# EAGLE design Alimentation (EAGLE 7.2.0)
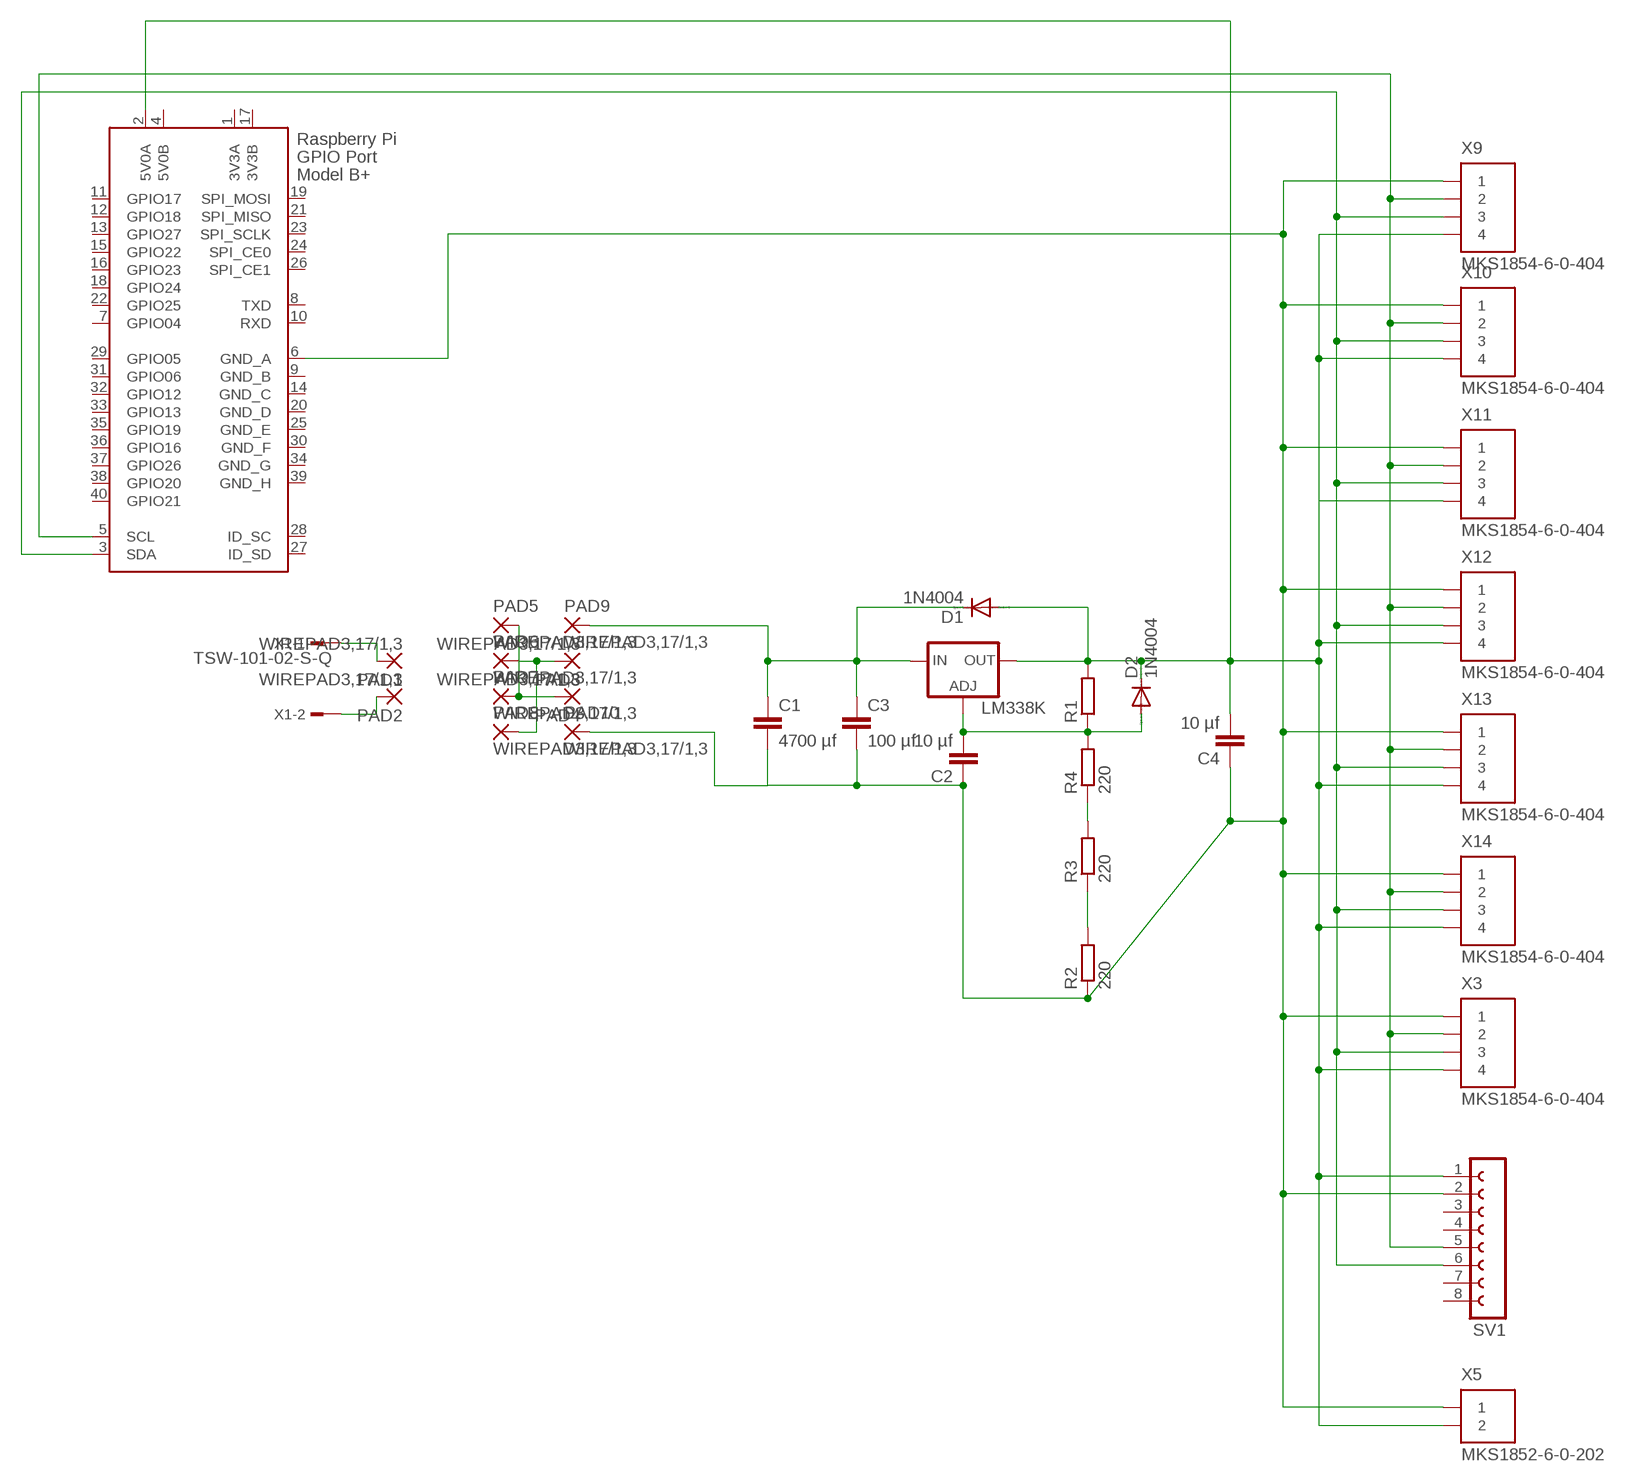
[diagram p0: schematic, sheet 1]

## Parts
C1  4700 µf  C-EU075-032X103  [C075-032X103]
C2  10 µf  C22/6  [C22.5B6]
C3  100 µf  C-EU050-075X075  [C050-075X075]
C4  10 µf  C22/6  [C22.5B6]
D1  1N4004  [DO41-10]
D2  1N4004  [DO41-10]
LM338K  LM317-TO3  [TO3-K02]
PAD1  WIREPAD3,17/1,3  [3,17/1,3]
PAD2  WIREPAD3,17/1,3  [3,17/1,3]
PAD3  WIREPAD3,17/1,3  [3,17/1,3]
PAD4  WIREPAD3,17/1,3  [3,17/1,3]
PAD5  WIREPAD3,17/1,3  [3,17/1,3]
PAD6  WIREPAD3,17/1,3  [3,17/1,3]
PAD7  WIREPAD3,17/1,3  [3,17/1,3]
PAD8  WIREPAD3,17/1,3  [3,17/1,3]
PAD9  WIREPAD3,17/1,3  [3,17/1,3]
PAD10  WIREPAD3,17/1,3  [3,17/1,3]
R1  R-EU_0309/12  [0309/12]
R2  220  R-EU_0309/12  [0309/12]
R3  220  R-EU_0309/12  [0309/12]
R4  220  R-EU_0309/12  [0309/12]
SV1  FE08-1  [FE08]
X1  TSW-101-02-S-Q  [TSW-101-02-S-Q]
X2  RASPI_GPIO_B+#_PIN  [RASPI_GPIO_B+_PIN]
X3  MKS1854-6-0-404  [MKS1854-6-0-404]
X5  MKS1852-6-0-202  [MKS1852-6-0-202]
X9  MKS1854-6-0-404  [MKS1854-6-0-404]
X10  MKS1854-6-0-404  [MKS1854-6-0-404]
X11  MKS1854-6-0-404  [MKS1854-6-0-404]
X12  MKS1854-6-0-404  [MKS1854-6-0-404]
X13  MKS1854-6-0-404  [MKS1854-6-0-404]
X14  MKS1854-6-0-404  [MKS1854-6-0-404]

## Nets
N$1: PAD1.1(P) X1.1
N$2: PAD2.1(P) X1.2
N$3: C1.2 C2.1 C3.2 C4.1 PAD10.1(P) R2.1 SV1.2 X2.6(GND_A) X3.1 X5.1 X9.1 X10.1 X11.1 X12.1 X13.1 X14.1
N$4: C1.1 C3.1 D1.C LM338K.1(IN) PAD9.1(P)
N$5: PAD3.1(P) PAD6.1(P) PAD8.1(P)
N$6: PAD4.1(P) PAD5.1(P) PAD7.1(P)
N$7: SV1.6 X2.3(SDA) X3.3 X9.3 X10.3 X11.3 X12.3 X13.3 X14.3
N$8: C2.2 D2.A LM338K.2(ADJ) R1.1 R4.2
N$9: R2.2 R3.1
N$10: C4.2 D1.A D2.C LM338K.3(OUT) R1.2 SV1.1 X2.2(5V0A) X3.4 X5.2 X9.4 X10.4 X11.4 X12.4 X13.4 X14.4
N$11: R3.2 R4.1
N$12: SV1.5 X2.5(SCL) X3.2 X9.2 X10.2 X11.2 X12.2 X13.2 X14.2
Unconnected: SV1.3 SV1.4 SV1.7 SV1.8 X2.7(GPIO04) X2.8(TXD) X2.10(RXD) X2.11(GPIO17) X2.12(GPIO18) X2.13(GPIO27) X2.15(GPIO22) X2.16(GPIO23) X2.18(GPIO24) X2.19(SPI_MOSI) X2.21(SPI_MISO) X2.22(GPIO25) X2.23(SPI_SCLK) X2.24(SPI_CE0) X2.26(SPI_CE1) X2.27(ID_SD) X2.28(ID_SC) X2.29(GPIO05) X2.31(GPIO06) X2.32(GPIO12) X2.33(GPIO13) X2.35(GPIO19) X2.36(GPIO16) X2.37(GPIO26) X2.38(GPIO20) X2.40(GPIO21)

## Power pins joined to a net without a drawn wire
3V3A: X2.1(3V3A)
3V3B: X2.17(3V3B)
5V0B: X2.4(5V0B)
GND_B: X2.9(GND_B)
GND_C: X2.14(GND_C)
GND_D: X2.20(GND_D)
GND_E: X2.25(GND_E)
GND_F: X2.30(GND_F)
GND_G: X2.34(GND_G)
GND_H: X2.39(GND_H)

## Library data of the parts
C1 C3 = rcl:C-EU: CAPACITOR, European symbol
C2 C4 = capacitor-wima:C: CAPACITOR naming: grid - package width
D1 D2 = diode:1N4004: DIODE general purpose rectifier, 1 A
LM338K = v-reg:LM317-TO3: VOLTAGE REGULATOR
PAD1-PAD10 = wirepad:WIREPAD: Wire PAD connect wire on PCB
R1-R4 = rcl:R-EU_: RESISTOR, European symbol
SV1 = con-lsta:FE08-1: FEMALE HEADER; OC_FARNELL: unknown; OC_NEWARK: unknown
X1 = con-samtec:TSW-101-02-S-Q: THROUGH-HOLE .025" SQ POST HEADER Source: Samtec TSW.pdf; OC_FARNELL: unknown; OC_NEWARK: unknown
X2 = raspberrypi_Bastelstube_v13:RASPI_GPIO_B+#: 2x20 header connector, all pins connected
X3 X9-X14 = con-stocko:MKS1854-6-0-404: Serie MKS 1850 Lötstifte In-line, Raster 2.5 mm, Stiftwannen, stehend, mit Rastlasche Source: http://www.stocko.de/de/index.php?seite=ka_rfk2_mks1850.html&rubrik=Katalog+-+RFK+2 rfk_1850.pdf; OC_FARNELL: 1141862; OC_NEWARK: unknown
X5 = con-stocko:MKS1852-6-0-202: Serie MKS 1850 Lötstifte In-line, Raster 2.5 mm, Stiftwannen, stehend, mit Rastlasche Source: http://www.stocko.de/de/index.php?seite=ka_rfk2_mks1850.html&rubrik=Katalog+-+RFK+2 rfk_1850.pdf; OC_FARNELL: unknown; OC_NEWARK: unknown

## Board
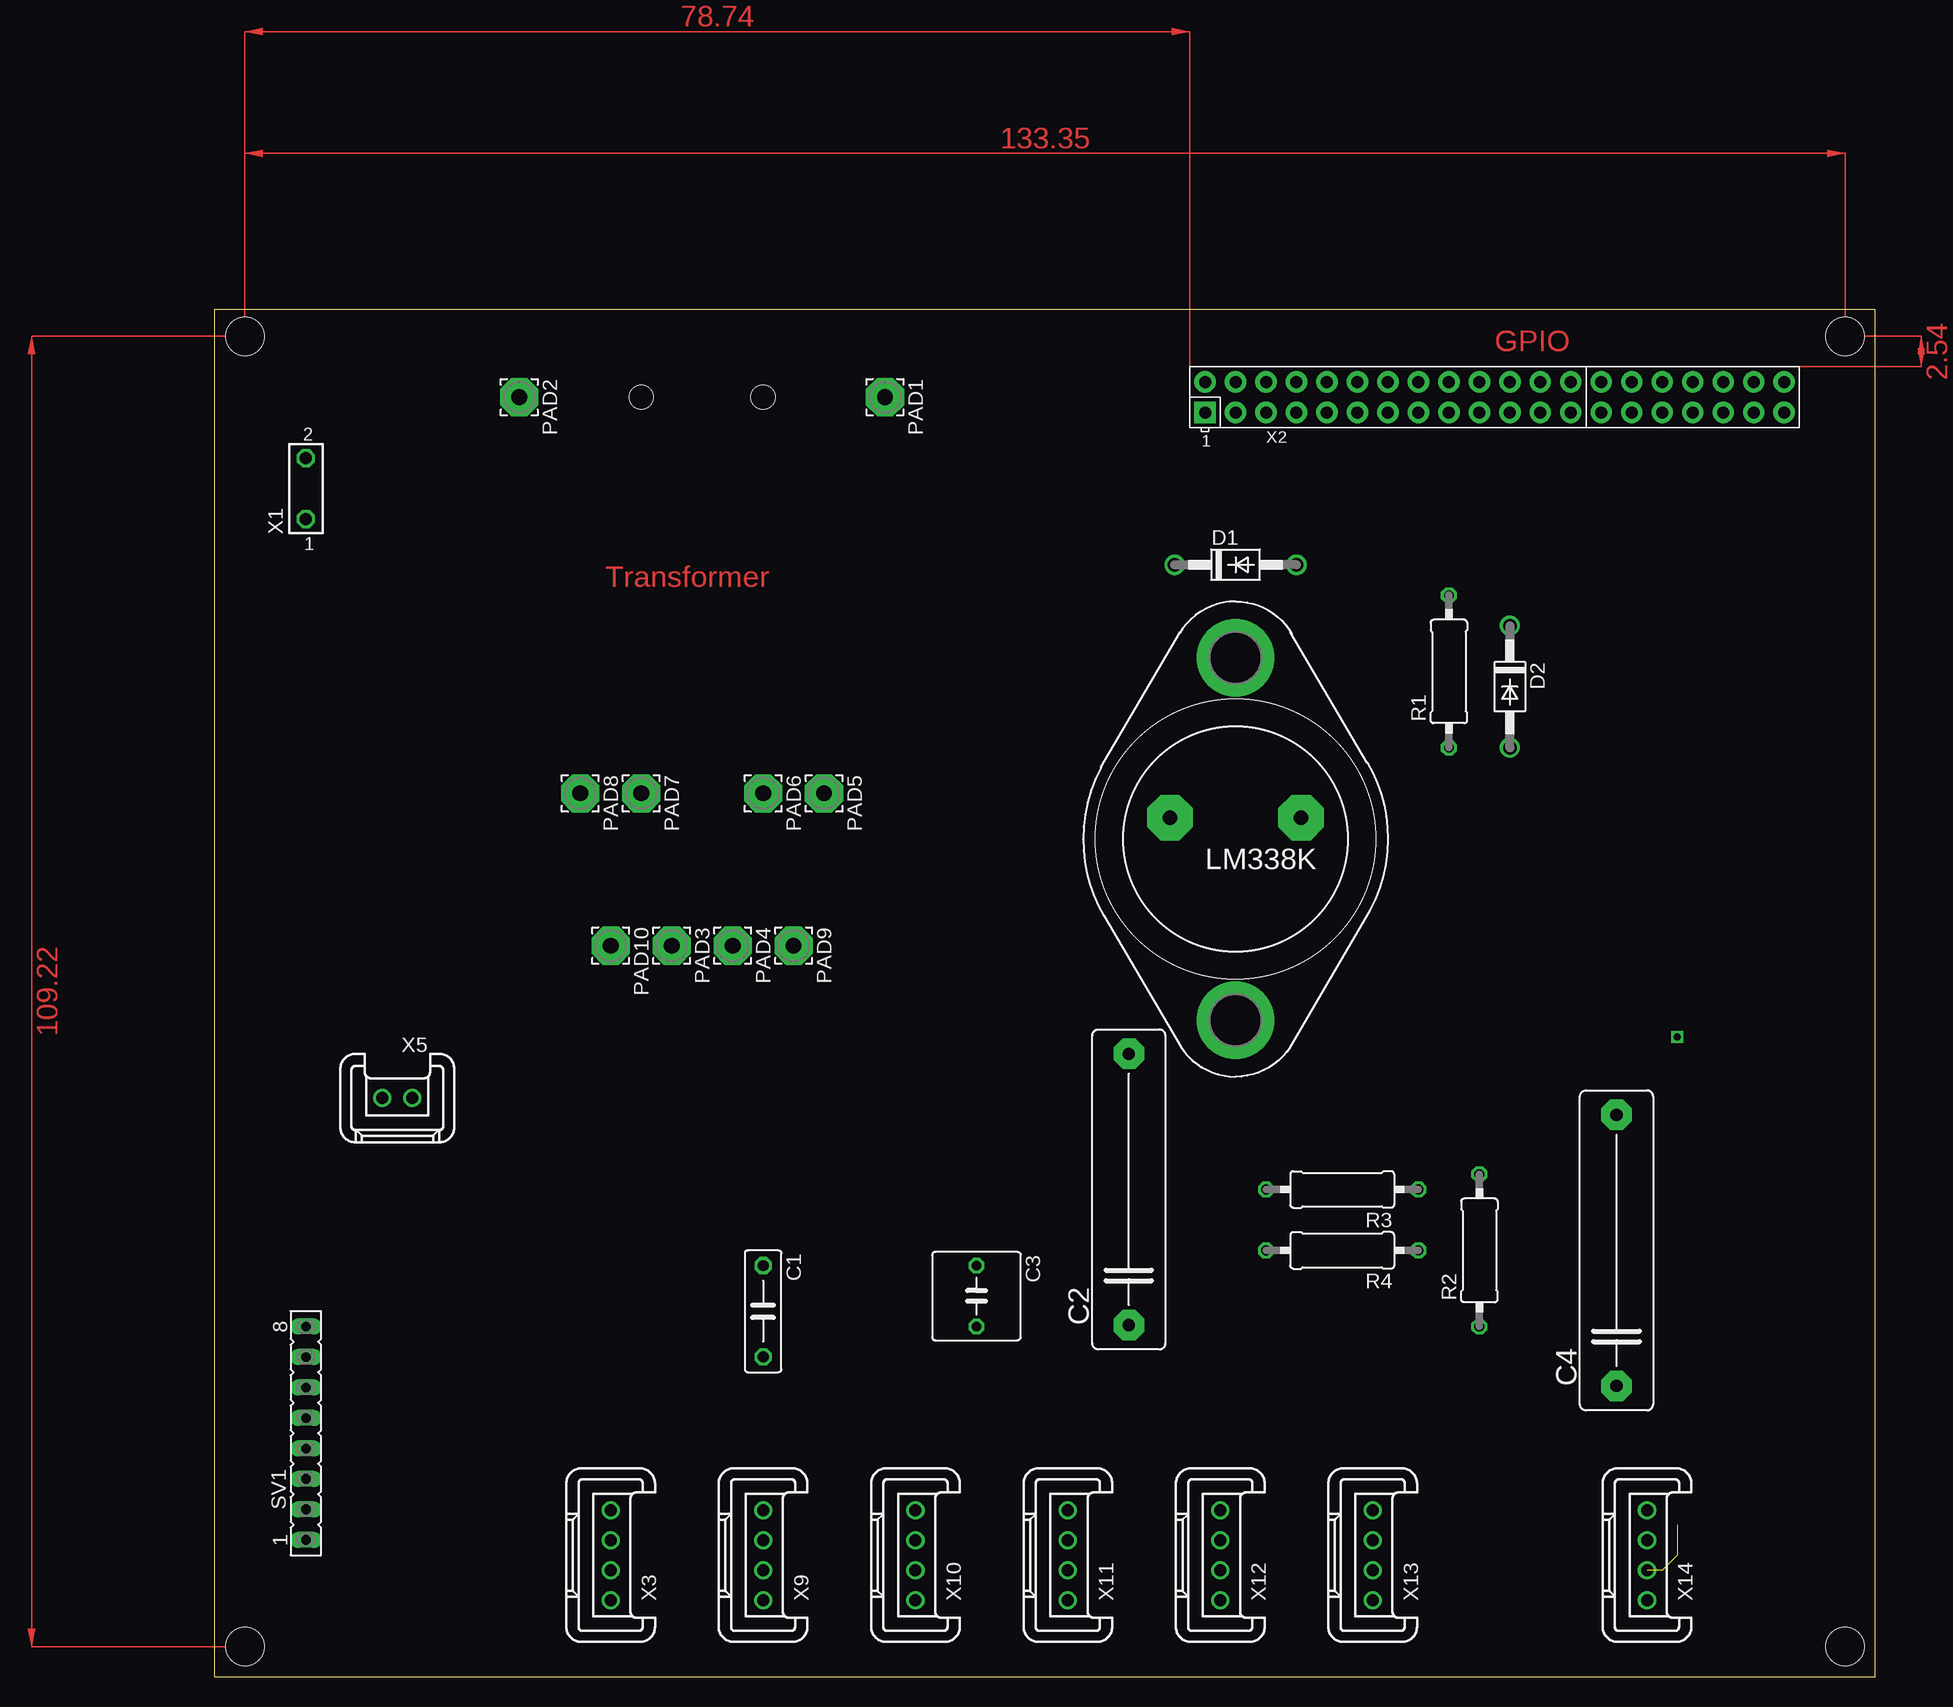
[diagram p1: board, top side]
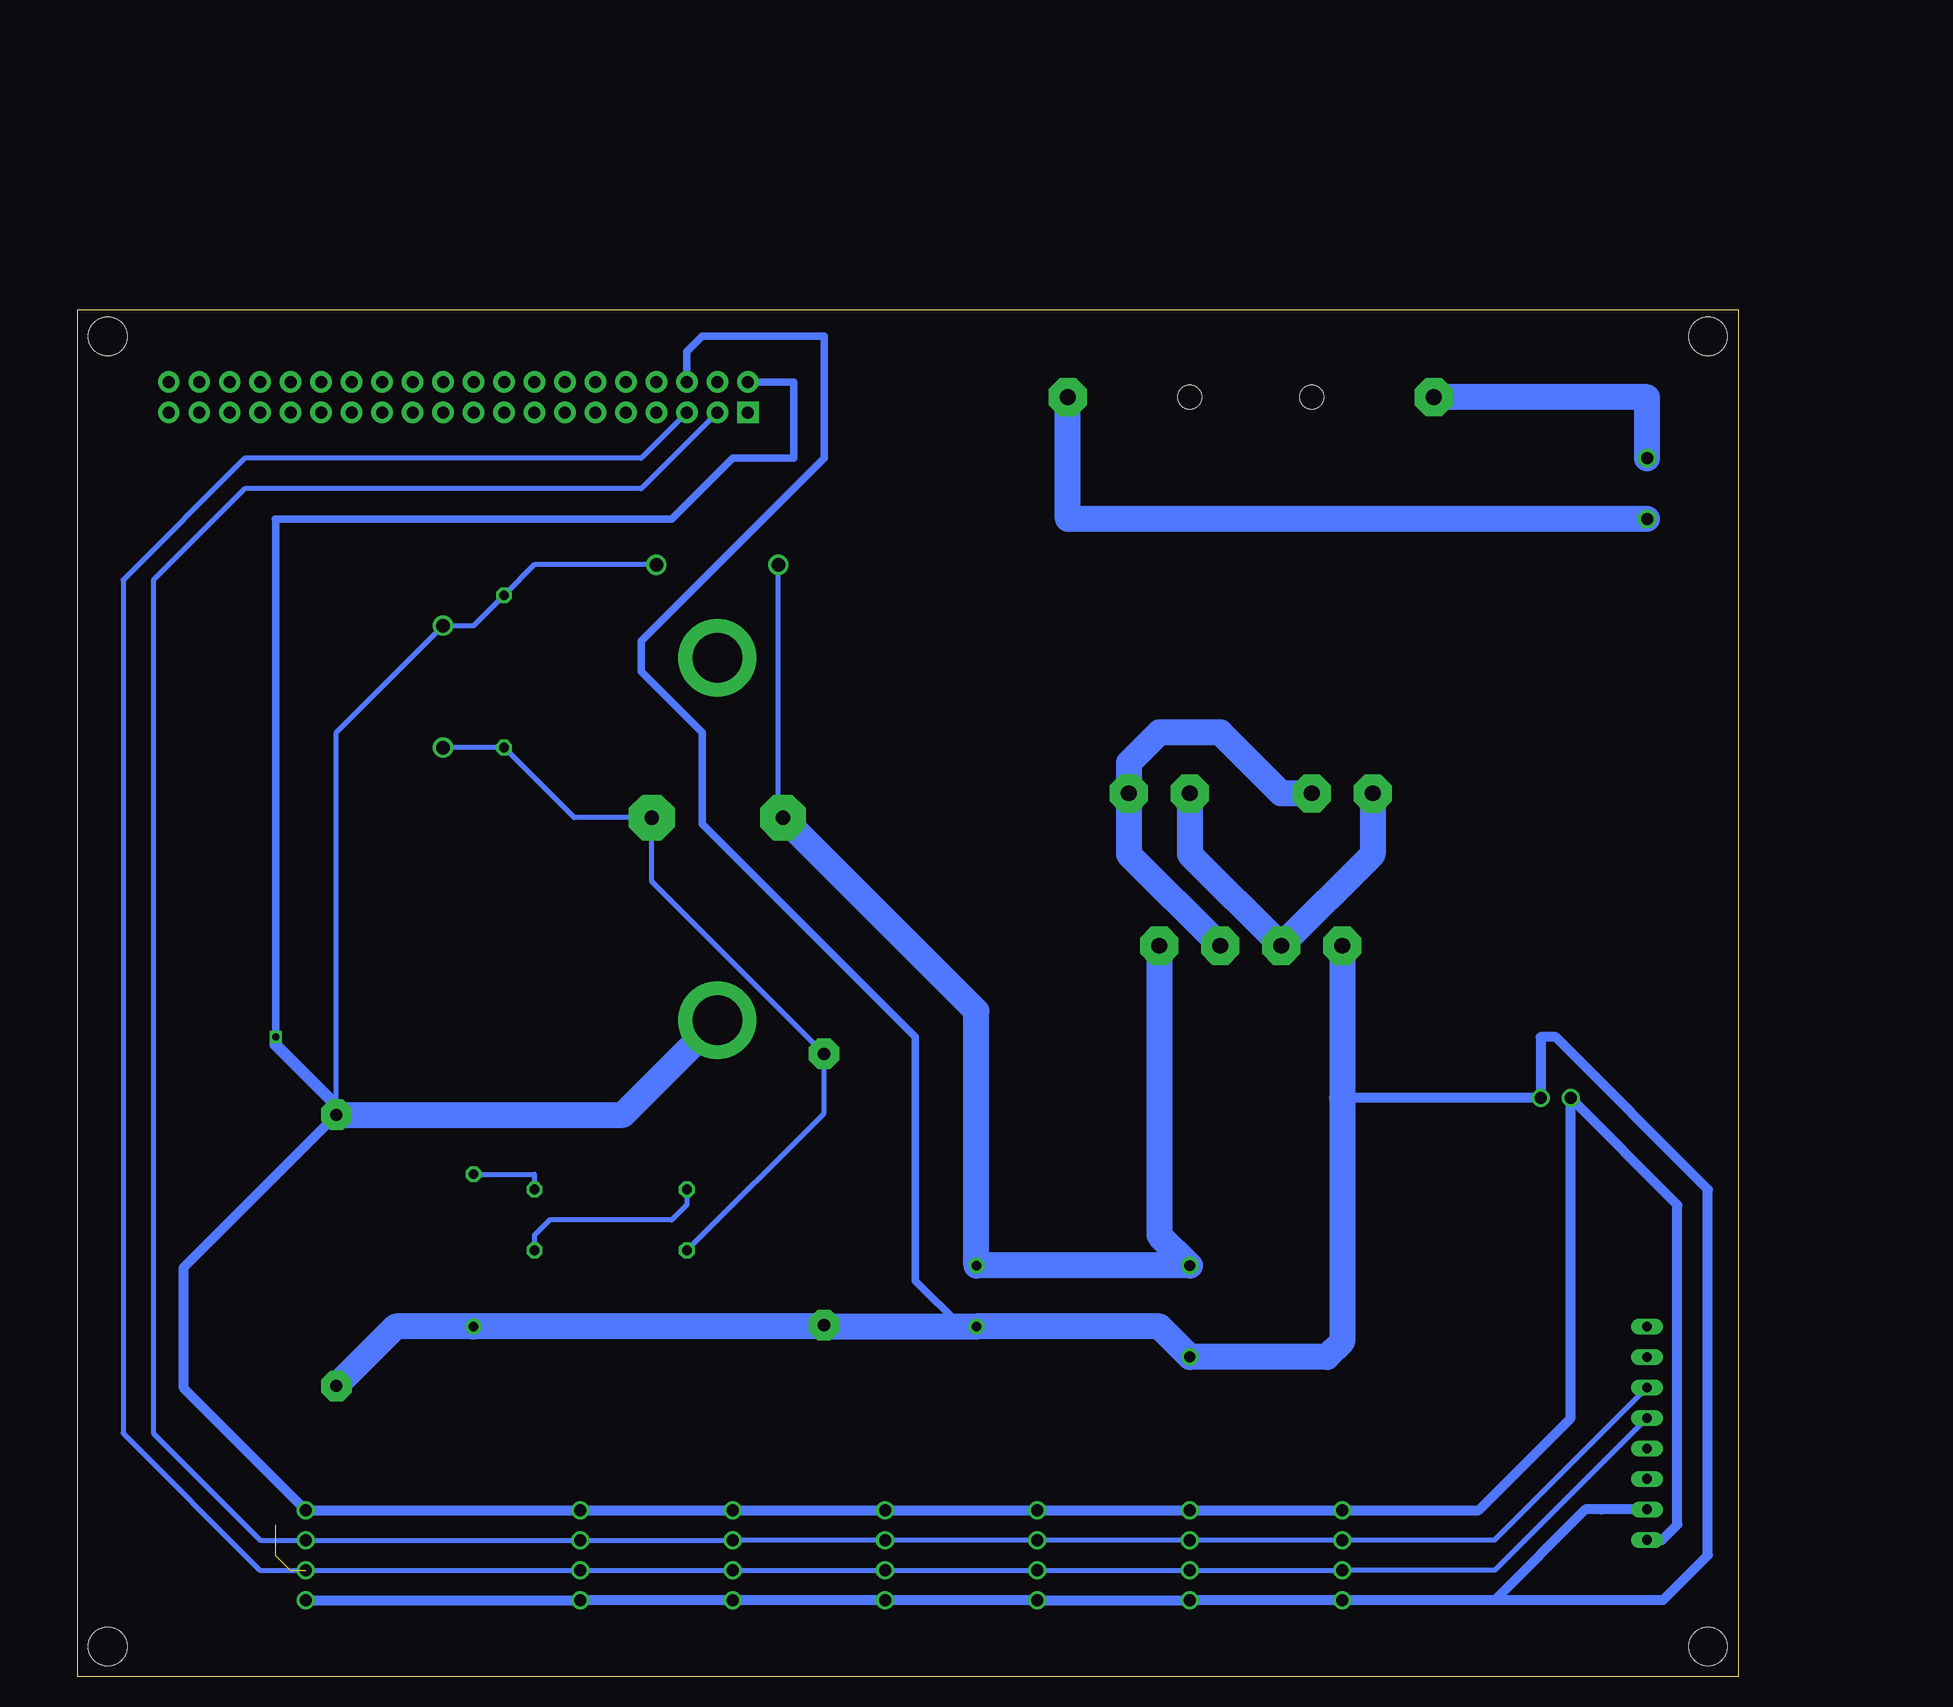
[diagram p2: board, bottom side, seen from below]

Size 138.41 x 113.97 mm. Coordinates in mm from the lower left corner, seen from the top.
Outline: 0,0 138.41,0 138.41,113.97 0,113.97 0,0
Copper layers (1*16): Top 0.035mm / dielectric 1.5mm / Bottom 0.035mm
Design rules "default": minimum track width 10mil, minimum drill 24mil, track to track 8mil, track to pad 8mil, pad to pad 8mil, via to via 8mil, smd to smd 8mil, copper to edge 40mil, drill to drill 8mil, minimum pad ring 10mil, minimum via ring 8mil, stop-mask expansion 4mil, vias tented up to drill 0mil, thermal gap 10mil
Holes 3.2 mm at 135.89,2.54 135.89,111.76 2.54,111.76 2.54,2.54
Holes 2 mm at 45.72,106.68 35.56,106.68

### Footprints (pad centres in the part's own frame; a part is rotated, then mirrored left to right if it is on the bottom)
C075-032X103 = drill 0.914 octagon: 1 -3.81,0; 2 3.81,0
C22.5B6 = drill 1.016 pad 2.54 octagon: 1 -11.303,0; 2 11.303,0
C050-075X075 = drill 0.813 octagon: 1 -2.54,0; 2 2.54,0
DO41-10 = drill 1.118: A 5.08,0; C -5.08,0
TO3-K02 = drill 1.194 pad 3.81 octagon: 1 -1.778,-5.461; 2 -1.778,5.461 | drill 4.115 pad 6.477: 3 15.113,0; 3@ -15.113,0
3,17/1,3 = drill 1.321 pad 3.175 octagon: 1 0,0
0309/12 = drill 0.813 octagon: 1 -6.35,0; 2 6.35,0
FE08 = drill 0.813 long: 1 -8.89,0; 2 -6.35,0; 3 -3.81,0; 4 -1.27,0; 5 1.27,0; 6 3.81,0; 7 6.35,0; 8 8.89,0
TSW-101-02-S-Q = drill 1 pad 1.5 octagon: 1 0,-2.54; 2 0,2.54
RASPI_GPIO_B+_PIN = drill 1 pad 1.778 square: 1 -24.13,-1.27 | drill 1 pad 1.778: 2 -24.13,1.27; 3 -21.59,-1.27; 4 -21.59,1.27; 5 -19.05,-1.27; 6 -19.05,1.27; 7 -16.51,-1.27; 8 -16.51,1.27; 9 -13.97,-1.27; 10 -13.97,1.27; 11 -11.43,-1.27; 12 -11.43,1.27; 13 -8.89,-1.27; 14 -8.89,1.27; 15 -6.35,-1.27; 16 -6.35,1.27; 17 -3.81,-1.27; 18 -3.81,1.27; 19 -1.27,-1.27; 20 -1.27,1.27; 21 1.27,-1.27; 22 1.27,1.27; 23 3.81,-1.27; 24 3.81,1.27; 25 6.35,-1.27; 26 6.35,1.27; 27 8.89,-1.27; 28 8.89,1.27; 29 11.43,-1.27; 30 11.43,1.27; 31 13.97,-1.27; 32 13.97,1.27; 33 16.51,-1.27; 34 16.51,1.27; 35 19.05,-1.27; 36 19.05,1.27; 37 21.59,-1.27; 38 21.59,1.27; 39 24.13,-1.27; 40 24.13,1.27
MKS1854-6-0-404 = drill 1 pad 1.422: 1 -3.75,0; 2 -1.25,0; 3 1.25,0; 4 3.75,0
MKS1852-6-0-202 = drill 1 pad 1.422: 1 -1.25,0; 2 1.25,0

### Placement (x,y rotation side)
C1  45.72,30.48 270 top
C2  76.2,40.64 90 top
C3  63.5,31.75 270 top
C4  116.84,35.56 90 top
D1  85.09,92.71 0 top
D2  107.95,82.55 270 top
LM338K  85.09,69.85 270 top
PAD1  55.88,106.68 270 top
PAD2  25.4,106.68 270 top
PAD3  38.1,60.96 270 top
PAD4  43.18,60.96 270 top
PAD5  50.8,73.66 270 top
PAD6  45.72,73.66 270 top
PAD7  35.56,73.66 270 top
PAD8  30.48,73.66 270 top
PAD9  48.26,60.96 270 top
PAD10  33.02,60.96 270 top
R1  102.87,83.82 90 top
R2  105.41,35.56 90 top
R3  93.98,40.64 180 top
R4  93.98,35.56 180 top
SV1  7.62,20.32 90 top
X1  7.62,99.06 0 top
X2  106.68,106.68 0 top
X3  33.02,10.16 90 top
X5  15.24,48.26 180 top
X9  45.72,10.16 90 top
X10  58.42,10.16 90 top
X11  71.12,10.16 90 top
X12  83.82,10.16 90 top
X13  96.52,10.16 90 top
X14  119.38,10.16 90 top

### Tracks (layer width: path | path; a pad name or v marks a point on that pad's centre or on a via)
N$1
  Bottom 2.184: X1.1 55.88,96.52 PAD1.1
N$2
  Bottom 2.184: X1.2 7.62,106.68 PAD2.1
N$3
  Bottom 0.406: C1.2 46.13,26.67
  Bottom 0.61: X2.6 87.63,110.49 86.36,111.76 76.2,111.76 76.2,101.6 91.44,86.36 91.44,83.82 86.36,78.74 86.36,71.12 68.58,53.34 68.58,33.02 64.77,29.21 C3.2
  Bottom 0.813: X14.1 X13.1 X12.1 X11.1 X10.1 X9.1 X3.1 20.32,6.41 | 11.43,13.97 SV1.2 12.76,13.97 20.32,6.41 | 20.32,6.41 6.29,6.41 2.54,10.16 2.54,40.64 15.24,53.34 16.49,53.34 X5.1 33.02,48.26
  Bottom 2.184: PAD10.1 33.02,48.26 33.02,27.94 34.29,26.67 C1.2 48.26,29.21 C3.2 76.07,29.21 C2.1 76.33,29.21 R2.1 111.89,29.21 C4.1
N$4
  Bottom 0.406: LM338K.1 80.01,72.01 D1.C
  Bottom 2.184: PAD9.1 48.26,36.83 C1.1 C3.1 63.5,55.5 LM338K.1
N$5
  Bottom 2.184: PAD6.1 45.72,68.58 PAD3.1 30.48,68.58 PAD8.1
N$6
  Bottom 2.184: PAD4.1 50.8,68.58 PAD5.1 50.8,76.2 48.26,78.74 43.18,78.74 38.1,73.66 PAD7.1
N$7
  Bottom 0.406: X2.3 91.44,99.06 124.46,99.06 132.08,91.44 132.08,20.32 123.17,11.41 X14.3 X13.3 X12.3 X11.3 X10.3 X9.3 X3.3 20.34,11.41 SV1.6
N$8
  Bottom 0.406: D2.A R1.1 97.03,71.63 LM338K.2 90.55,66.29 C2.2 76.2,46.99 R4.2
N$9
  Bottom 0.406: R2.2 100.33,41.91 R3.1
N$10  (via drill 0.6)
  Bottom 0.406: D1.A 100.33,92.71 R1.2 105.41,87.63 D2.C 116.84,78.74 C4.2
  Bottom 0.61: C4.2 116.84,47.64 | 121.9,52.7 v121.9,53.34 121.9,96.5 121.92,96.52 88.9,96.52 83.82,101.6 78.74,101.6 78.74,107.95 X2.2
  Bottom 0.813: C4.2 129.54,34.16 129.54,24.07 X14.4 X13.4 X12.4 X11.4 X10.4 X9.4 X3.4 21.65,13.91 13.99,21.57 X5.2 5.08,39.35 5.08,12.7 6.35,11.43 SV1.1
  Bottom 1.016: 116.84,47.64 121.9,52.7
  Bottom 2.184: C4.2 92.96,46.86 LM338K.3
N$11
  Bottom 0.406: R3.2 87.63,39.37 88.9,38.1 99.06,38.1 100.33,36.83 R4.1
N$12  (3 unrouted)
  Bottom 0.406: X2.5 91.44,101.6 124.46,101.6 134.62,91.44 134.62,20.32 123.21,8.91 X14.2 X13.2 X12.2 X11.2 X10.2 X9.2 X3.2 20.3,8.91 SV1.5
(copper drawn outside any net)
  shapes: Top area x4

### Text on the board
Top: GPIO | Transformer